# Altium schematic sheet BLOCK_DIAGRAM.SchDoc
size A2; SheetNumber: 1; SheetTotal: 6
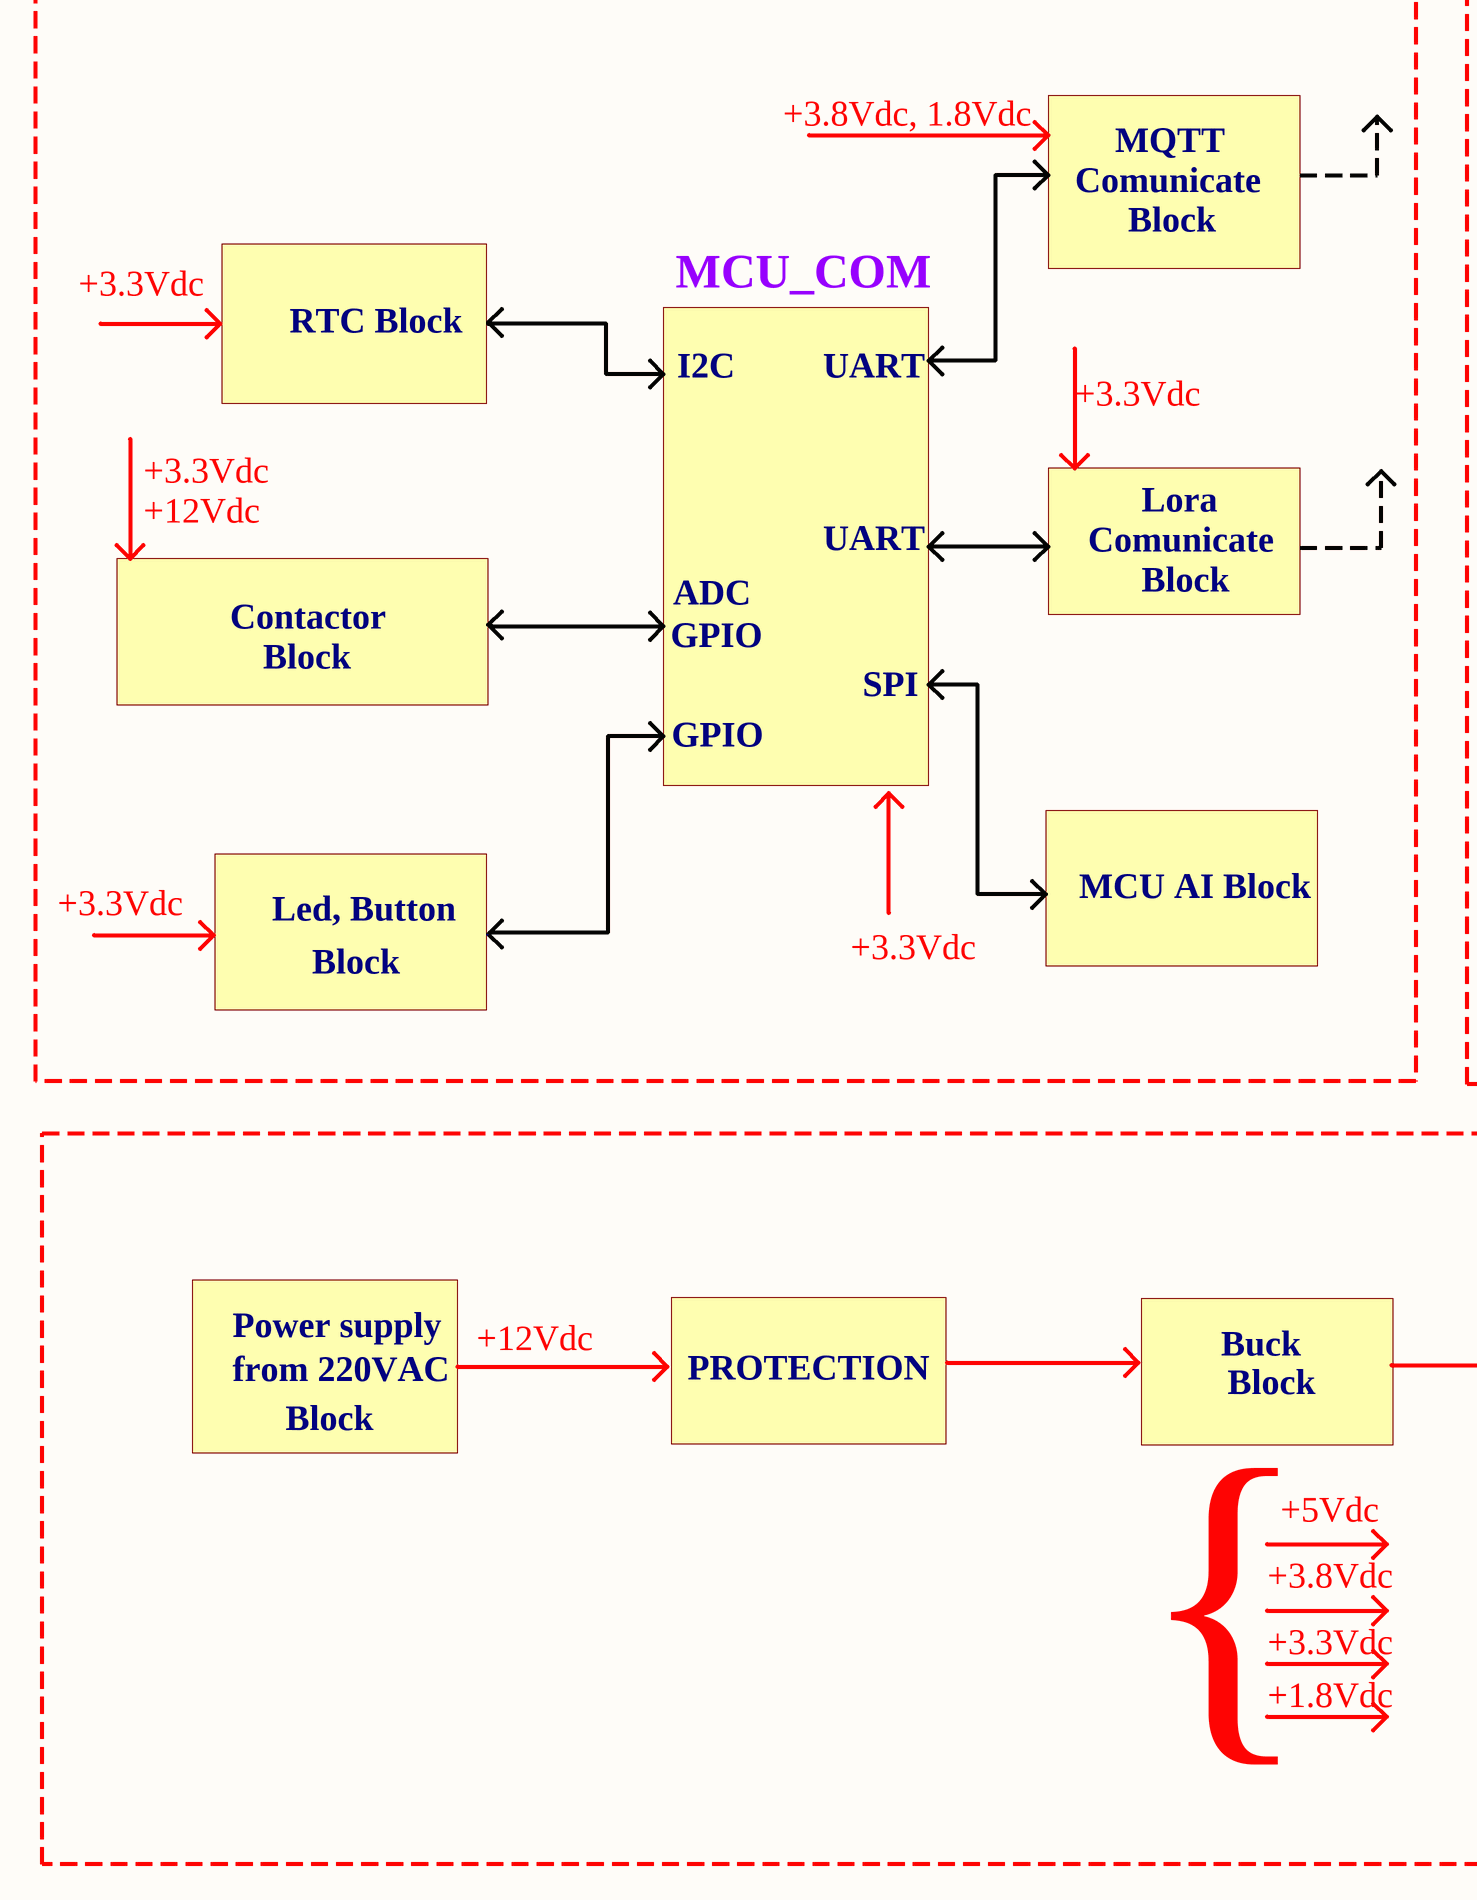
[diagram p0: BLOCK_DIAGRAM.SchDoc, left]
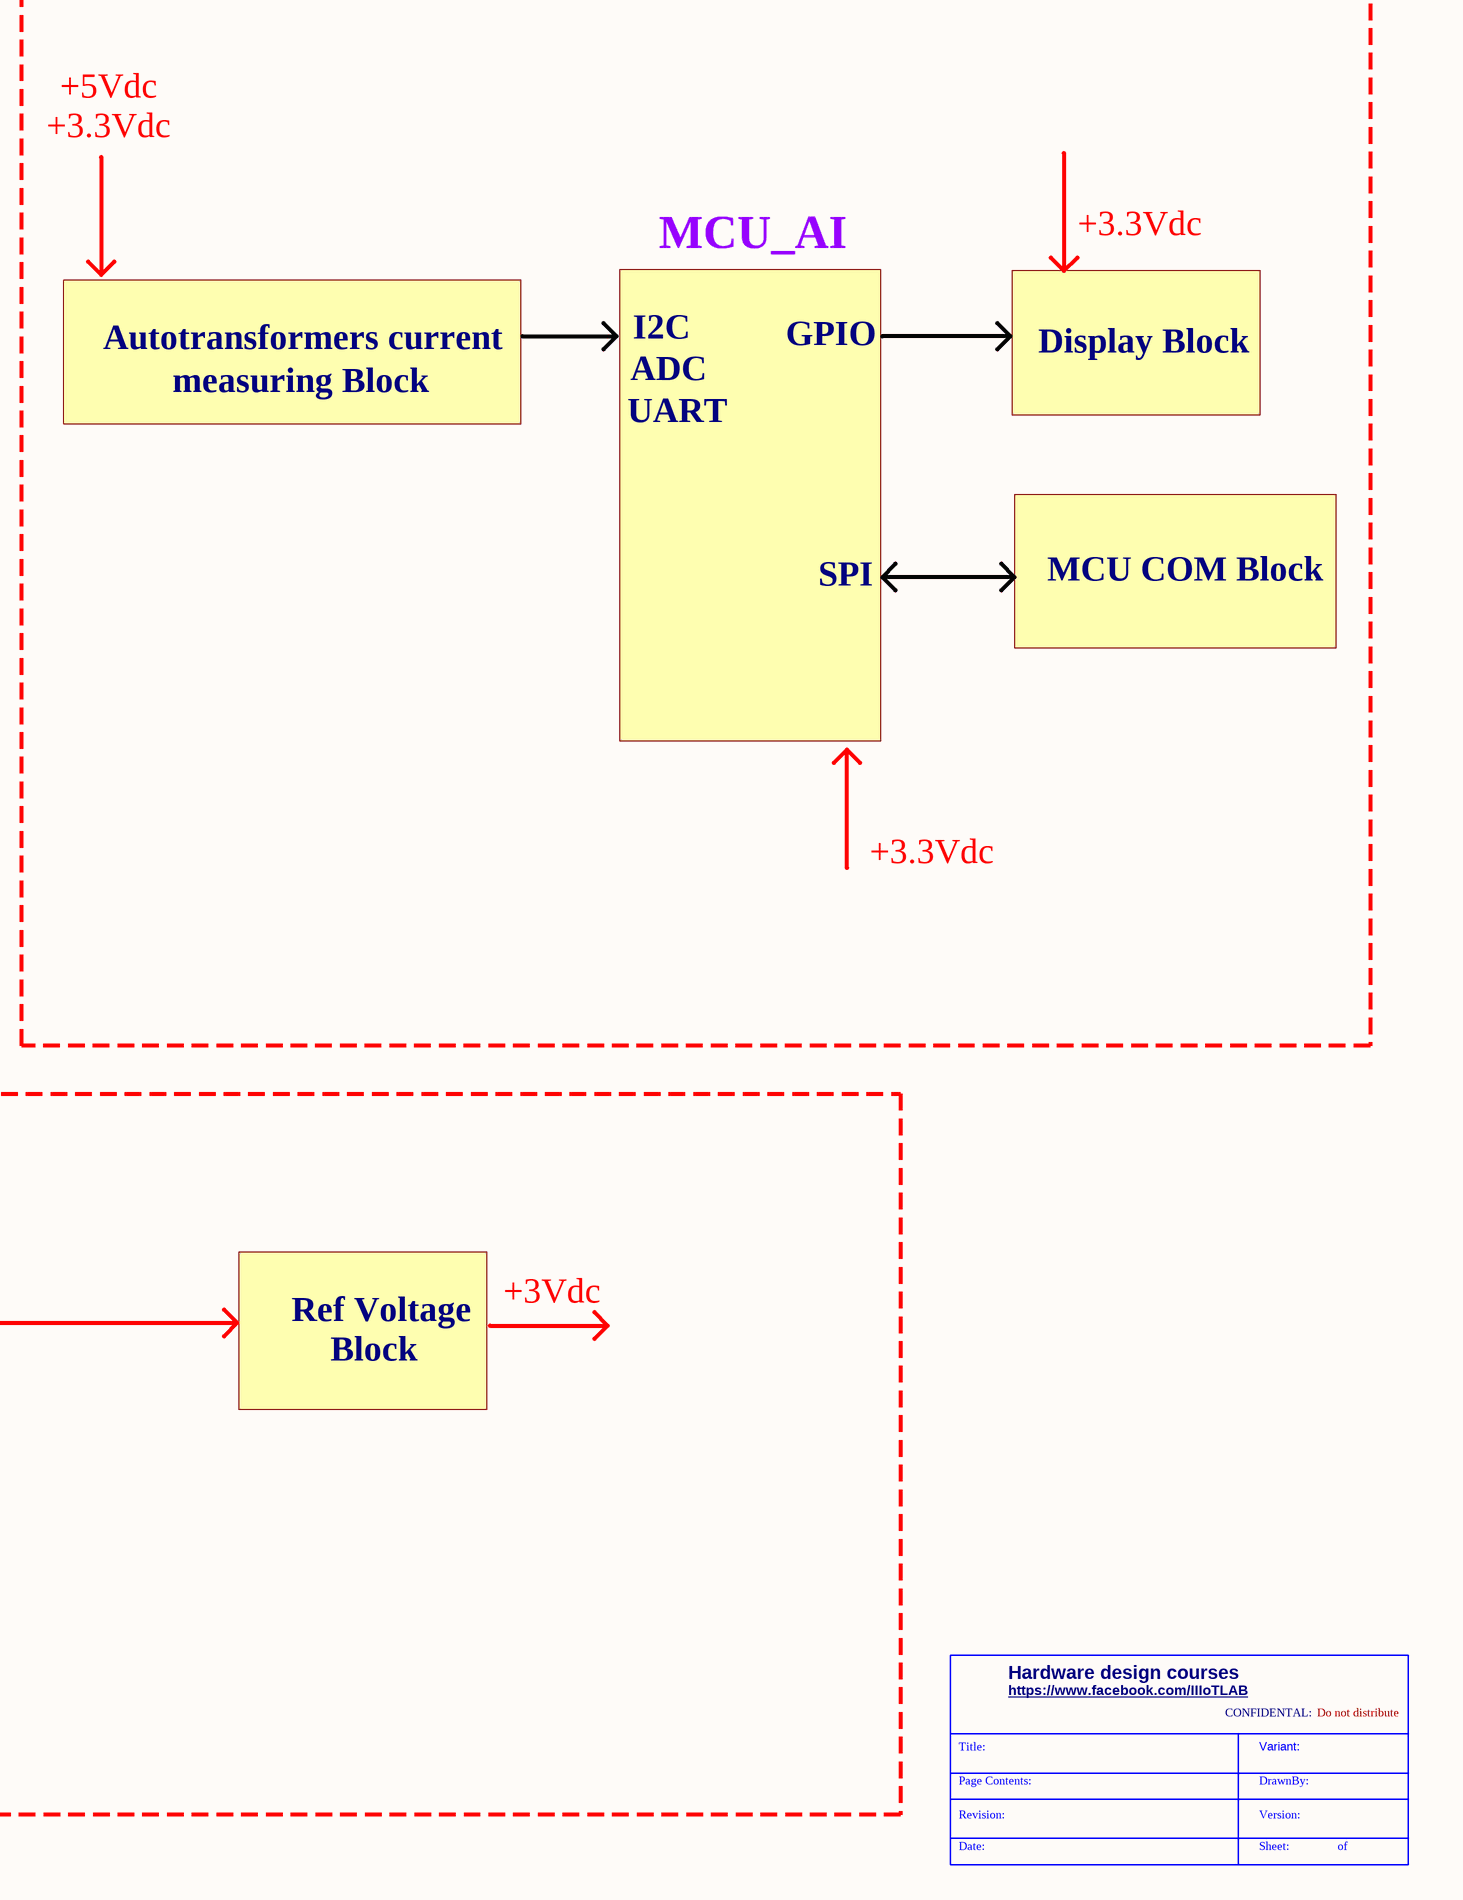
[diagram p1: BLOCK_DIAGRAM.SchDoc, right]

## Notes on the sheet
- +3.8Vdc, 1.8Vdc
- MQTT
- +3.3Vdc
- +5Vdc
- Comunicate
- Block
- MCU_COM
- MCU_AI
- RTC Block
- I2C
- UART
- Autotransformers current
- GPIO
- Display Block
- measuring Block
- ADC
- Lora
- +12Vdc
- Contactor
- SPI
- MCU COM Block
- MCU AI Block
- Led, Button
- Power supply
- from 220VAC
- PROTECTION
- Buck
- Ref Voltage
- +3Vdc
- +3.8Vdc
- +1.8Vdc
- Hardware design courses
- https://www.facebook.com/IIIoTLAB
- CONFIDENTAL:
- Do not distribute
- {
- Title:
- Page Contents:
- Variant:
- DrawnBy:
- Revision:
- Date:
- Sheet:
- Version:
- of